# EAGLE design bigTransBrd (EAGLE 9.1.2)
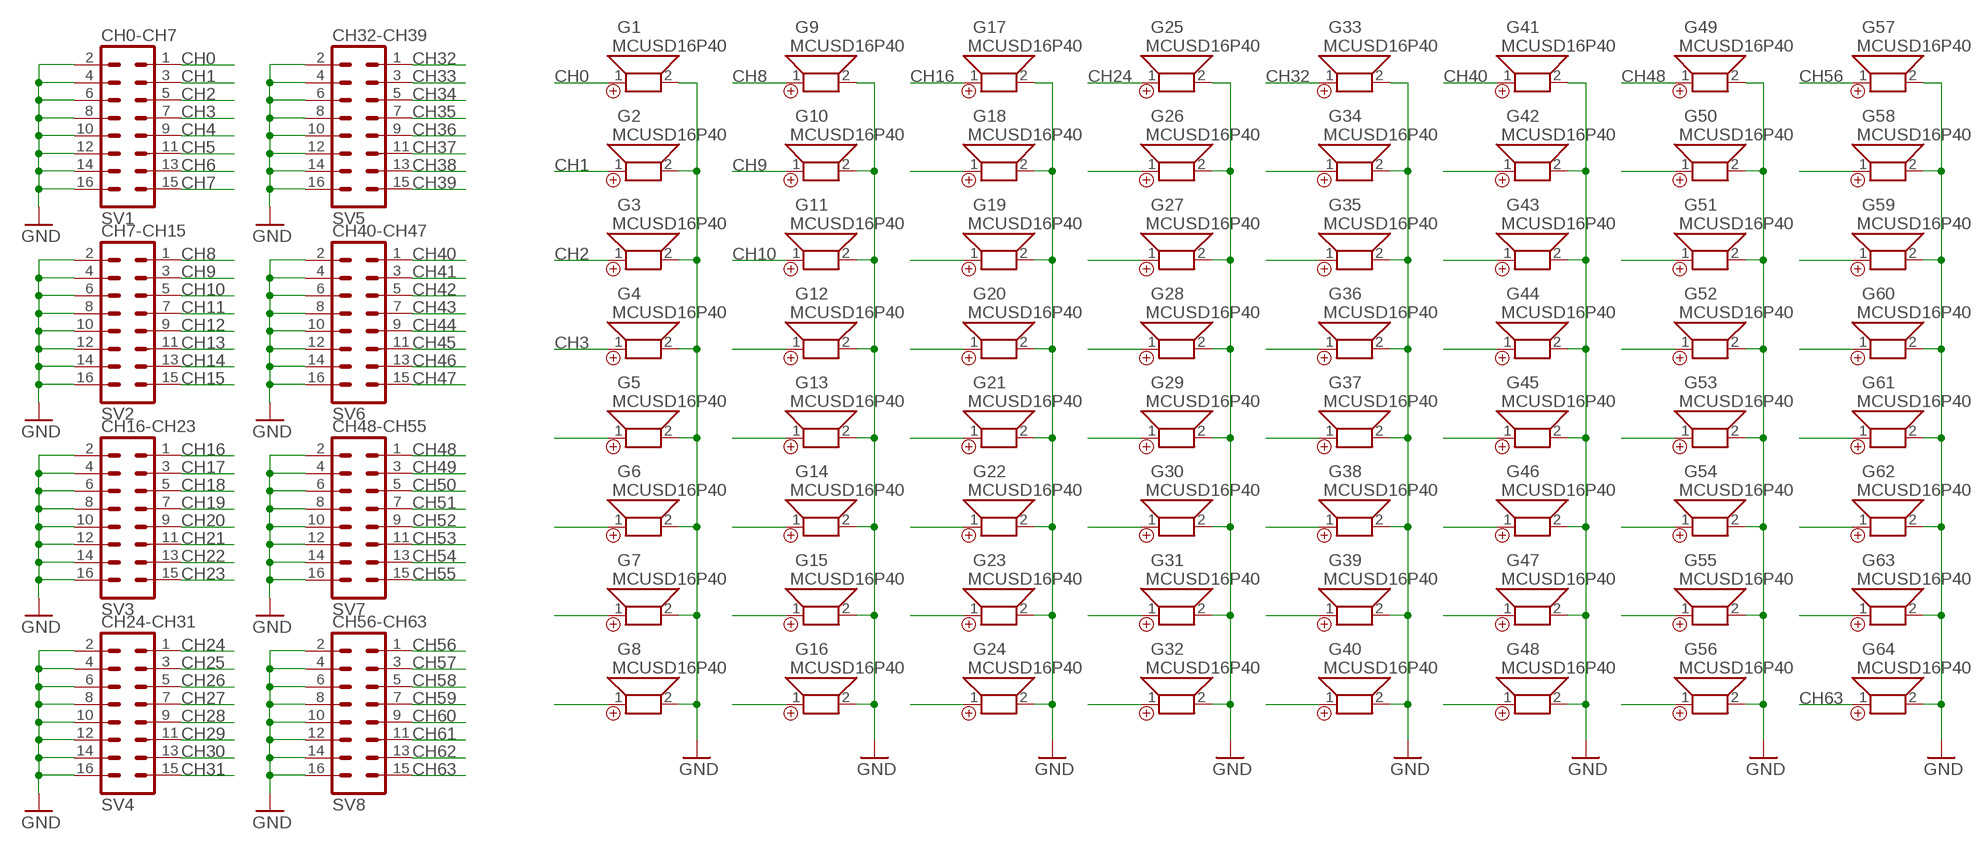
[diagram p0: schematic, sheet 1]

## Parts
G1  MCUSD16P40  [D16P40]
G2  MCUSD16P40  [D16P40]
G3  MCUSD16P40  [D16P40]
G4  MCUSD16P40  [D16P40]
G5  MCUSD16P40  [D16P40]
G6  MCUSD16P40  [D16P40]
G7  MCUSD16P40  [D16P40]
G8  MCUSD16P40  [D16P40]
G9  MCUSD16P40  [D16P40]
G10  MCUSD16P40  [D16P40]
G11  MCUSD16P40  [D16P40]
G12  MCUSD16P40  [D16P40]
G13  MCUSD16P40  [D16P40]
G14  MCUSD16P40  [D16P40]
G15  MCUSD16P40  [D16P40]
G16  MCUSD16P40  [D16P40]
G17  MCUSD16P40  [D16P40]
G18  MCUSD16P40  [D16P40]
G19  MCUSD16P40  [D16P40]
G20  MCUSD16P40  [D16P40]
G21  MCUSD16P40  [D16P40]
G22  MCUSD16P40  [D16P40]
G23  MCUSD16P40  [D16P40]
G24  MCUSD16P40  [D16P40]
G25  MCUSD16P40  [D16P40]
G26  MCUSD16P40  [D16P40]
G27  MCUSD16P40  [D16P40]
G28  MCUSD16P40  [D16P40]
G29  MCUSD16P40  [D16P40]
G30  MCUSD16P40  [D16P40]
G31  MCUSD16P40  [D16P40]
G32  MCUSD16P40  [D16P40]
G33  MCUSD16P40  [D16P40]
G34  MCUSD16P40  [D16P40]
G35  MCUSD16P40  [D16P40]
G36  MCUSD16P40  [D16P40]
G37  MCUSD16P40  [D16P40]
G38  MCUSD16P40  [D16P40]
G39  MCUSD16P40  [D16P40]
G40  MCUSD16P40  [D16P40]
G41  MCUSD16P40  [D16P40]
G42  MCUSD16P40  [D16P40]
G43  MCUSD16P40  [D16P40]
G44  MCUSD16P40  [D16P40]
G45  MCUSD16P40  [D16P40]
G46  MCUSD16P40  [D16P40]
G47  MCUSD16P40  [D16P40]
G48  MCUSD16P40  [D16P40]
G49  MCUSD16P40  [D16P40]
G50  MCUSD16P40  [D16P40]
G51  MCUSD16P40  [D16P40]
G52  MCUSD16P40  [D16P40]
G53  MCUSD16P40  [D16P40]
G54  MCUSD16P40  [D16P40]
G55  MCUSD16P40  [D16P40]
G56  MCUSD16P40  [D16P40]
G57  MCUSD16P40  [D16P40]
G58  MCUSD16P40  [D16P40]
G59  MCUSD16P40  [D16P40]
G60  MCUSD16P40  [D16P40]
G61  MCUSD16P40  [D16P40]
G62  MCUSD16P40  [D16P40]
G63  MCUSD16P40  [D16P40]
G64  MCUSD16P40  [D16P40]
SV1  CH0-CH7  ML16  [ML16]
SV2  CH7-CH15  ML16  [ML16]
SV3  CH16-CH23  ML16  [ML16]
SV4  CH24-CH31  ML16  [ML16]
SV5  CH32-CH39  ML16  [ML16]
SV6  CH40-CH47  ML16  [ML16]
SV7  CH48-CH55  ML16  [ML16]
SV8  CH56-CH63  ML16  [ML16]

## Nets
CH0: G1.1 SV1.1
CH1: G2.1 SV1.3
CH2: G3.1 SV1.5
CH3: G4.1 SV1.7
CH4: G5.1 SV1.9
CH5: G6.1 SV1.11
CH6: G7.1 SV1.13
CH7: G8.1 SV1.15
CH8: G9.1 SV2.1
CH9: G10.1 SV2.3
CH10: G11.1 SV2.5
CH11: G12.1 SV2.7
CH12: G13.1 SV2.9
CH13: G14.1 SV2.11
CH14: G15.1 SV2.13
CH15: G16.1 SV2.15
CH16: G17.1 SV3.1
CH17: G18.1 SV3.3
CH18: G19.1 SV3.5
CH19: G20.1 SV3.7
CH20: G21.1 SV3.9
CH21: G22.1 SV3.11
CH22: G23.1 SV3.13
CH23: G24.1 SV3.15
CH24: G25.1 SV4.1
CH25: G26.1 SV4.3
CH26: G27.1 SV4.5
CH27: G28.1 SV4.7
CH28: G29.1 SV4.9
CH29: G30.1 SV4.11
CH30: G31.1 SV4.13
CH31: G32.1 SV4.15
CH32: G33.1 SV5.1
CH33: G34.1 SV5.3
CH34: G35.1 SV5.5
CH35: G36.1 SV5.7
CH36: G37.1 SV5.9
CH37: G38.1 SV5.11
CH38: G39.1 SV5.13
CH39: G40.1 SV5.15
CH40: G41.1 SV6.1
CH41: G42.1 SV6.3
CH42: G43.1 SV6.5
CH43: G44.1 SV6.7
CH44: G45.1 SV6.9
CH45: G46.1 SV6.11
CH46: G47.1 SV6.13
CH47: G48.1 SV6.15
CH48: G49.1 SV7.1
CH49: G50.1 SV7.3
CH50: G51.1 SV7.5
CH51: G52.1 SV7.7
CH52: G53.1 SV7.9
CH53: G54.1 SV7.11
CH54: G55.1 SV7.13
CH55: G56.1 SV7.15
CH56: G57.1 SV8.1
CH57: G58.1 SV8.3
CH58: G59.1 SV8.5
CH59: G60.1 SV8.7
CH60: G61.1 SV8.9
CH61: G62.1 SV8.11
CH62: G63.1 SV8.13
CH63: G64.1 SV8.15
GND: G1.2 G2.2 G3.2 G4.2 G5.2 G6.2 G7.2 G8.2 G9.2 G10.2 G11.2 G12.2 G13.2 G14.2 G15.2 G16.2 G17.2 G18.2 G19.2 G20.2 G21.2 G22.2 G23.2 G24.2 G25.2 G26.2 G27.2 G28.2 G29.2 G30.2 G31.2 G32.2 G33.2 G34.2 G35.2 G36.2 G37.2 G38.2 G39.2 G40.2 G41.2 G42.2 G43.2 G44.2 G45.2 G46.2 G47.2 G48.2 G49.2 G50.2 G51.2 G52.2 G53.2 G54.2 G55.2 G56.2 G57.2 G58.2 G59.2 G60.2 G61.2 G62.2 G63.2 G64.2 SV1.2 SV1.4 SV1.6 SV1.8 SV1.10 SV1.12 SV1.14 SV1.16 SV2.2 SV2.4 SV2.6 SV2.8 SV2.10 SV2.12 SV2.14 SV2.16 SV3.2 SV3.4 SV3.6 SV3.8 SV3.10 SV3.12 SV3.14 SV3.16 SV4.2 SV4.4 SV4.6 SV4.8 SV4.10 SV4.12 SV4.14 SV4.16 SV5.2 SV5.4 SV5.6 SV5.8 SV5.10 SV5.12 SV5.14 SV5.16 SV6.2 SV6.4 SV6.6 SV6.8 SV6.10 SV6.12 SV6.14 SV6.16 SV7.2 SV7.4 SV7.6 SV7.8 SV7.10 SV7.12 SV7.14 SV7.16 SV8.2 SV8.4 SV8.6 SV8.8 SV8.10 SV8.12 SV8.14 SV8.16

## Library data of the parts
G1-G64 = projectLib:MCUSD16P40: MULTICOMP 16mm 40kHz ultrasonic transducer
SV1-SV8 = con-harting-ml:ML16: HARTING; OC_FARNELL: unknown; OC_NEWARK: unknown

## Board
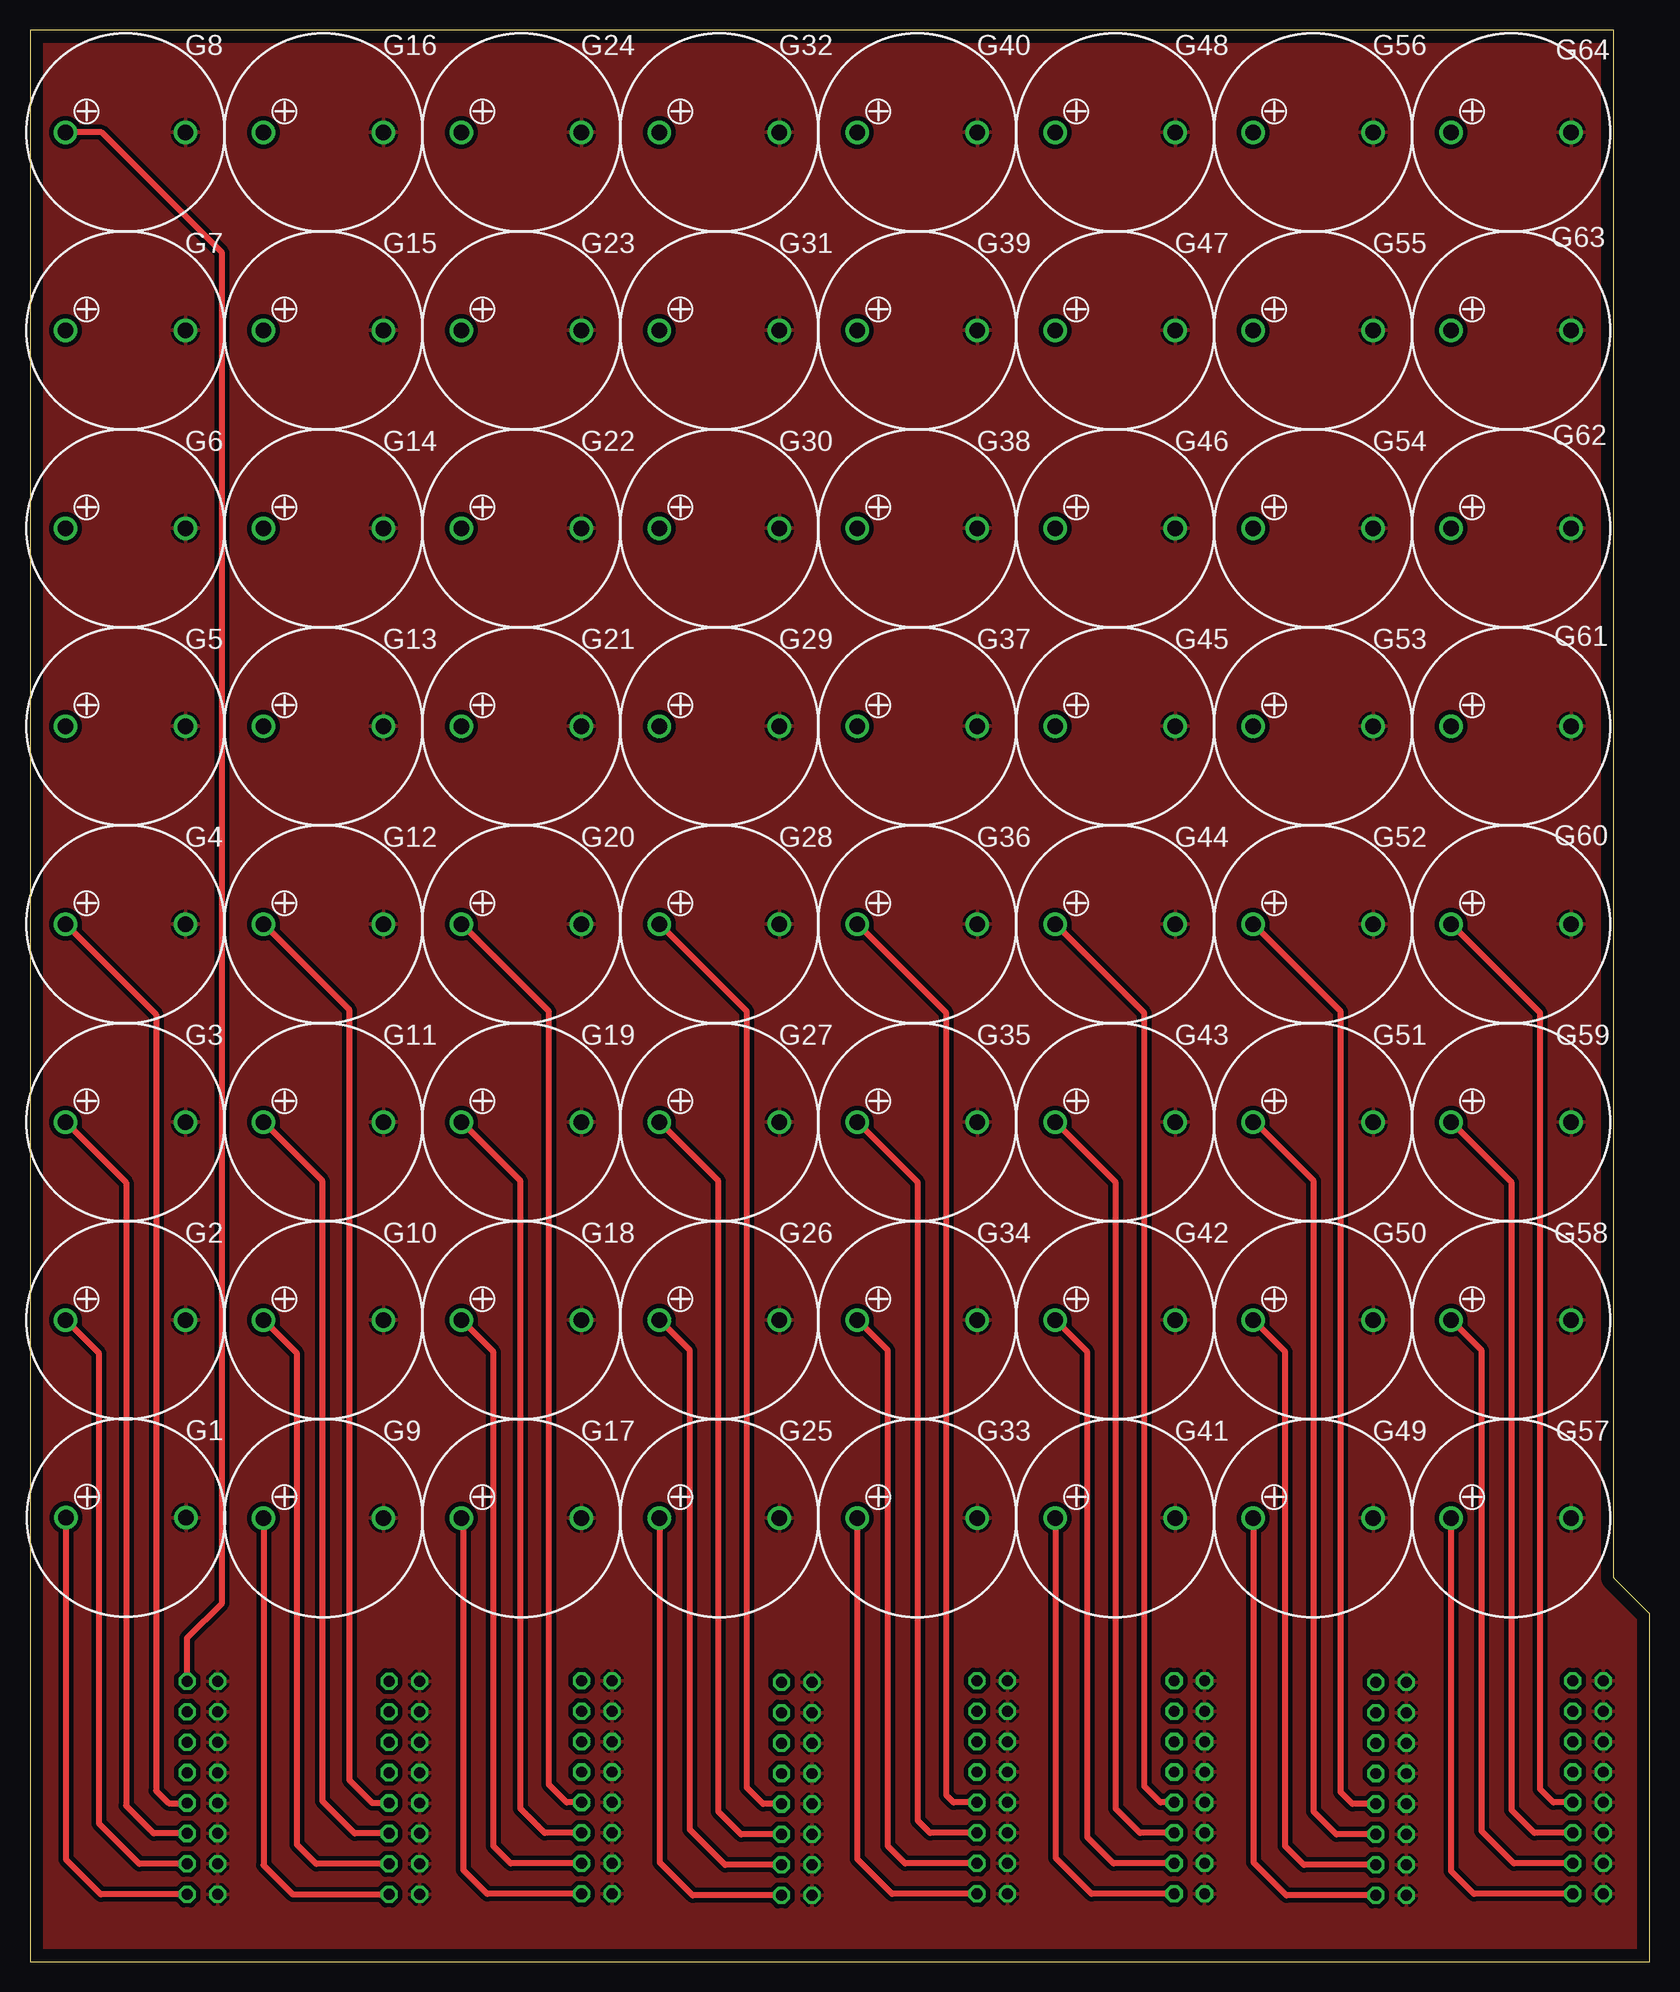
[diagram p1: board, top side]
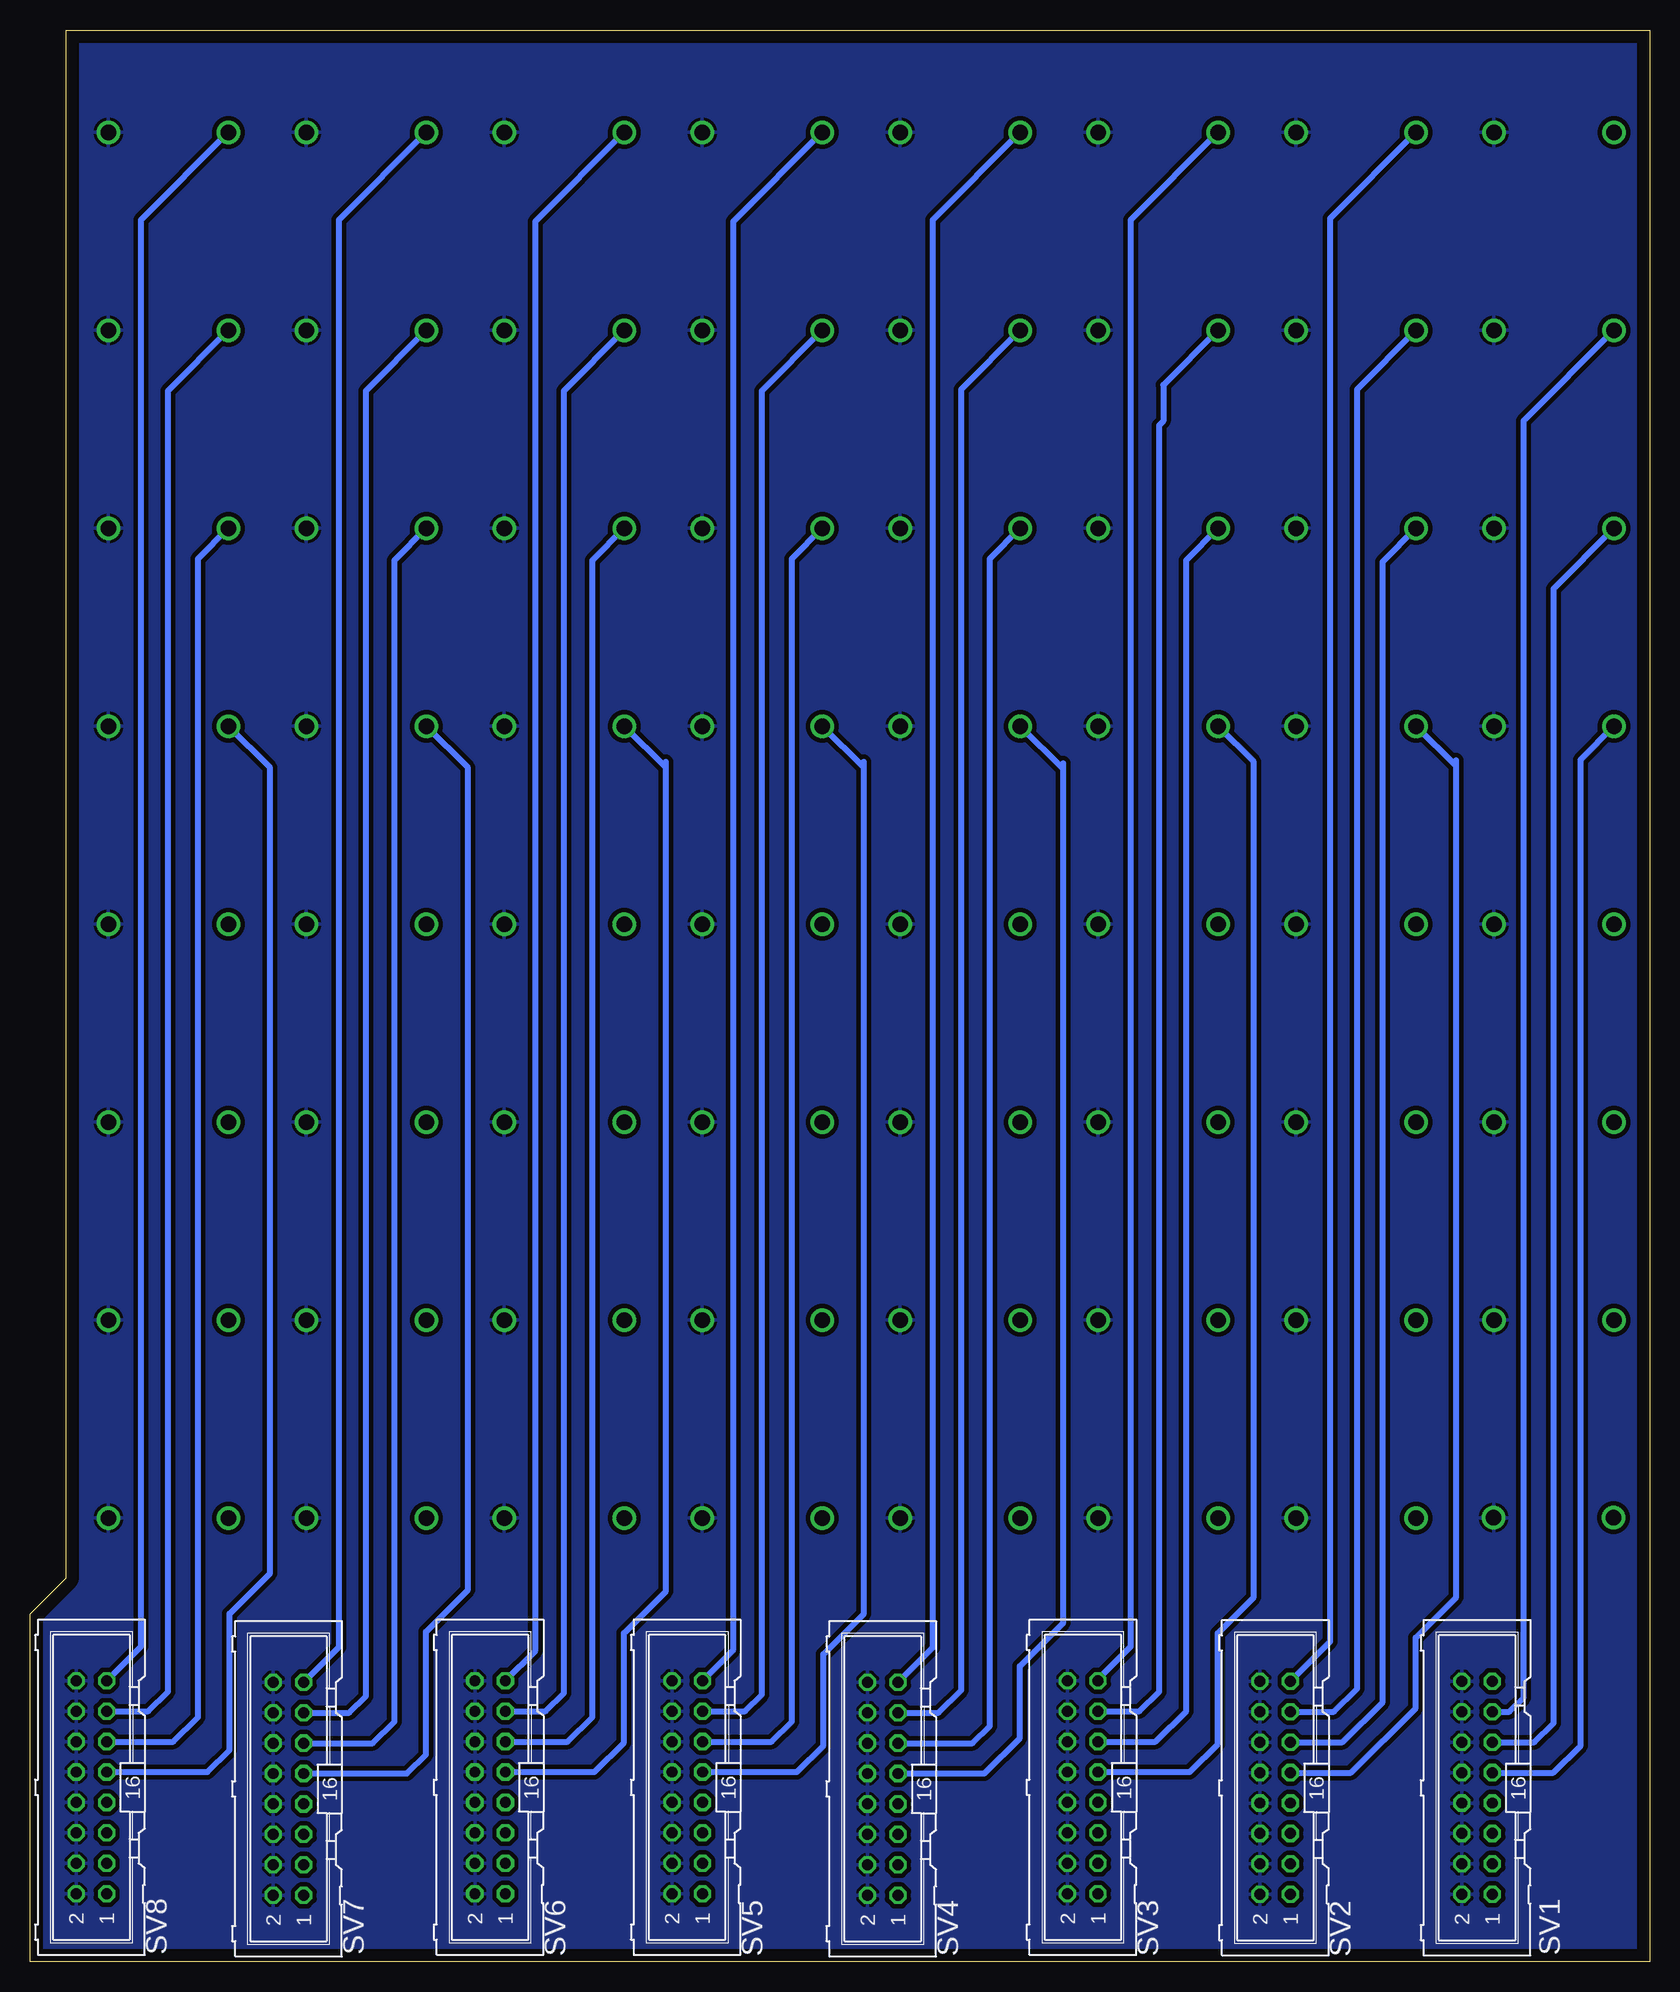
[diagram p2: board, bottom side, seen from below]

Size 135 x 161 mm. Coordinates in mm from the lower left corner, seen from the top.
Outline: 0,0 94.5,0 135,0 135,29 132,32 132,161 0,161 0,0
Copper layers (1*16): Top 0.035mm / dielectric 1.5mm / Bottom 0.035mm
Design rules "default *": minimum track width 6mil, minimum drill 0.35mm, track to track 15mil, track to pad 15mil, pad to pad 15mil, via to via 15mil, smd to smd 12mil, copper to edge 40mil, drill to drill 6mil, minimum pad ring 10mil, minimum via ring 8mil, stop-mask expansion 4mil, vias tented up to drill 0mil, thermal gap 10mil

### Footprints (pad centres in the part's own frame; a part is rotated, then mirrored left to right if it is on the bottom)
D16P40 = drill 1.3: 1 -5,0; 2 5,0
ML16 = drill 0.914 octagon: 1 -8.89,-1.27; 2 -8.89,1.27; 3 -6.35,-1.27; 4 -6.35,1.27; 5 -3.81,-1.27; 6 -3.81,1.27; 7 -1.27,-1.27; 8 -1.27,1.27; 9 1.27,-1.27; 10 1.27,1.27; 11 3.81,-1.27; 12 3.81,1.27; 13 6.35,-1.27; 14 6.35,1.27; 15 8.89,-1.27; 16 8.89,1.27

### Placement (x,y rotation side)
G1  8,37 0 top
G2  7.96,53.46 0 top
G3  7.96,69.96 0 top
G4  7.96,86.46 0 top
G5  7.96,102.96 0 top
G6  7.96,119.46 0 top
G7  7.96,135.96 0 top
G8  7.96,152.46 0 top
G9  24.46,36.96 0 top
G10  24.46,53.46 0 top
G11  24.46,69.96 0 top
G12  24.46,86.46 0 top
G13  24.46,102.96 0 top
G14  24.46,119.46 0 top
G15  24.46,135.96 0 top
G16  24.46,152.46 0 top
G17  40.96,36.96 0 top
G18  40.96,53.46 0 top
G19  40.96,69.96 0 top
G20  40.96,86.46 0 top
G21  40.96,102.96 0 top
G22  40.96,119.46 0 top
G23  40.96,135.96 0 top
G24  40.96,152.46 0 top
G25  57.46,36.96 0 top
G26  57.46,53.46 0 top
G27  57.46,69.96 0 top
G28  57.46,86.46 0 top
G29  57.46,102.96 0 top
G30  57.46,119.46 0 top
G31  57.46,135.96 0 top
G32  57.46,152.46 0 top
G33  73.96,36.96 0 top
G34  73.96,53.46 0 top
G35  73.96,69.96 0 top
G36  73.96,86.46 0 top
G37  73.96,102.96 0 top
G38  73.96,119.46 0 top
G39  73.96,135.96 0 top
G40  73.96,152.46 0 top
G41  90.46,36.96 0 top
G42  90.46,53.46 0 top
G43  90.46,69.96 0 top
G44  90.46,86.46 0 top
G45  90.46,102.96 0 top
G46  90.46,119.46 0 top
G47  90.46,135.96 0 top
G48  90.46,152.46 0 top
G49  106.96,36.96 0 top
G50  106.96,53.46 0 top
G51  106.96,69.96 0 top
G52  106.96,86.46 0 top
G53  106.96,102.96 0 top
G54  106.96,119.46 0 top
G55  106.96,135.96 0 top
G56  106.96,152.46 0 top
G57  123.46,36.96 0 top
G58  123.46,53.46 0 top
G59  123.46,69.96 0 top
G60  123.46,86.46 0 top
G61  123.46,102.96 0 top
G62  123.46,119.46 0 top
G63  123.46,135.96 0 top
G64  123.46,152.46 0 top
SV1  14.37,14.48 90 bottom
SV2  31.2,14.48 90 bottom
SV3  47.23,14.52 90 bottom
SV4  63.91,14.4 90 bottom
SV5  80.22,14.52 90 bottom
SV6  96.65,14.52 90 bottom
SV7  113.45,14.4 90 bottom
SV8  129.88,14.52 90 bottom

### Tracks (layer width: path | path; a pad name or v marks a point on that pad's centre or on a via)
CH0
  Top 0.5: SV1.1 5.91,5.59 3,8.5 G1.1
CH1
  Top 0.5: SV1.3 9.12,8.13 5.75,11.5 5.75,50.67 G2.1
CH2
  Top 0.45: 9.75,11.25 10.25,10.75 10.33,10.67
  Top 0.5: G3.1 8,64.92 8,13 9.75,11.25 10.33,10.67 SV1.5
CH3
  Top 0.5: G4.1 10.5,78.92 10.5,14.25 11.54,13.21 SV1.7
CH4
  Bottom 0.5: SV1.9 8,15.75 5.75,18 5.75,100.17 G5.1
CH5
  Bottom 0.5: SV1.11 9.59,18.29 8,19.88 8,114.42 G6.1
CH6
  Bottom 0.5: SV1.13 11.67,20.83 10.5,22 10.5,128.42 G7.1
CH7
  Top 0.5: SV1.15 13.1,26.98 16,29.88 16,142.42 5.96,152.46 G8.1
CH8
  Top 0.5: SV2.1 21.91,5.59 19.46,8.04 G9.1
CH9
  Top 0.5: SV2.3 23.87,8.13 22.25,9.75 22.25,50.67 G10.1
CH10
  Top 0.5: SV2.5 27.08,10.67 24.38,13.38 24.38,65.05 G11.1
CH11
  Top 0.5: SV2.7 28.54,13.21 26.62,15.12 26.62,79.3 G12.1
CH12
  Bottom 0.5: SV2.9 24.88,15.75 19.5,21.12 19.5,27 16.12,30.38 | G13.1 16.12,99.63 16.12,30.38 | 16.12,30.38 16.12,100.13
CH13
  Bottom 0.5: SV2.11 25.59,18.29 22.25,21.62 22.25,116.67 G14.1
CH14
  Bottom 0.5: SV2.13 26.3,20.83 24.38,22.75 24.38,131.05 G15.1
CH15
  Bottom 0.5: SV2.15 26.62,26.67 26.62,145.3 G16.1
CH16
  Top 0.5: SV3.1 38.12,5.63 36.12,7.62 36.12,36.8 G17.1
CH17
  Top 0.5: SV3.3 40.08,8.17 38.62,9.62 38.62,50.8 G18.1
CH18
  Top 0.5: SV3.5 42.91,10.71 40.88,12.75 40.88,65.05 G19.1
CH19
  Top 0.5: SV3.7 44.75,13.25 43.25,14.75 43.25,79.17 G20.1
CH20
  Bottom 0.5: SV3.9 38.33,15.79 36,18.12 36,27.38 33,30.38 33,100 G21.1
CH21
  Bottom 0.5: SV3.11 41.17,18.33 38.62,20.88 38.62,116.8 G22.1
CH22
  Bottom 0.45: 40.52,128.4 40.88,128.05
  Bottom 0.5: SV3.13 42.5,20.87 40.88,22.5 40.88,128.05 | G23.1 40.52,131.4 40.52,128.4
CH23
  Bottom 0.5: G24.1 43.25,145.17 43.25,26.25 45.96,23.54 SV3.15
CH24
  Top 0.5: SV4.1 55.24,5.51 52.5,8.25 52.5,36.88 52.46,36.92 G25.1
CH25
  Top 0.5: SV4.3 57.95,8.05 55,11 55,50.92 G26.1
CH26
  Top 0.5: SV4.5 59.29,10.59 57.38,12.5 57.38,65.05 G27.1
CH27
  Top 0.5: SV4.7 61.12,13.13 59.75,14.5 59.75,79.17 G28.1
CH28
  Bottom 0.5: SV4.9 55.46,15.67 52.5,18.62 52.5,24.62 48.88,28.25 | G29.1 48.88,99.38 48.88,28.25 | 48.88,28.25 48.88,99.88
CH29
  Bottom 0.5: SV4.11 56.42,18.21 55,19.62 55,116.92 G30.1
CH30
  Bottom 0.5: SV4.13 59.25,20.75 57.38,22.62 57.38,131.05 G31.1
CH31
  Bottom 0.5: SV4.15 59.75,26.18 59.75,145.17 G32.1
CH32
  Top 0.5: SV5.1 71.87,5.63 68.96,8.54 G33.1
CH33
  Top 0.5: SV5.3 72.95,8.17 71.5,9.62 71.5,50.92 G34.1
CH34
  Top 0.5: SV5.5 75.04,10.71 74,11.75 74,64.92 G35.1
CH35
  Top 0.5: SV5.7 77,13.25 76.38,13.88 76.38,79.05 G36.1
CH36
  Bottom 0.5: SV5.9 71.08,15.79 68.88,18 68.88,25.62 65.5,29 | 65.5,29 65.5,99.5 G37.1 | 65.5,29 65.5,100
CH37
  Bottom 0.5: SV5.11 73.17,18.33 71.5,20 71.5,116.92 G38.1
CH38
  Bottom 0.5: SV5.13 75.38,20.87 74,22.25 74,130.92 G39.1
CH39
  Bottom 0.5: SV5.15 76.38,25.98 76.38,145.05 G40.1
CH40
  Top 0.5: SV6.1 88.49,5.63 85.5,8.62 85.5,36.92 G41.1
CH41
  Top 0.5: SV6.3 90.33,8.17 88.12,10.38 88.12,50.8 G42.1
CH42
  Top 0.5: SV6.5 92.54,10.71 90.5,12.75 90.5,64.92 G43.1
CH43
  Top 0.5: SV6.7 94.25,13.25 92.88,14.62 92.88,79.05 G44.1
CH44
  Bottom 0.5: SV6.9 87.96,15.79 85.5,18.25 85.5,27.38 82,30.88 | 82,30.88 82,99.5 G45.1 | 82,30.88 82,100
CH45
  Bottom 0.5: SV6.11 90.17,18.33 88.12,20.38 88.12,116.8 G46.1
CH46
  Bottom 0.5: SV6.13 92,20.87 90.5,22.38 90.5,130.92 G47.1
CH47
  Bottom 0.5: SV6.15 92.88,25.91 92.88,145.05 G48.1
CH48
  Top 0.5: SV7.1 104.74,5.51 102,8.25 102,36.92 G49.1
CH49
  Top 0.5: SV7.3 106.2,8.05 104.62,9.62 104.62,50.8 G50.1
CH50
  Top 0.5: SV7.5 108.91,10.59 107,12.5 107,65.05 102.08,69.96 G51.1
CH51
  Top 0.5: SV7.7 110.25,13.13 109.25,14.12 109.25,79.17 G52.1
CH52
  Bottom 0.5: SV7.9 103.58,15.67 102,17.25 102,27.5 98.5,31 | 98.5,31 98.5,99.5 G53.1 | 98.5,31 98.5,98
CH53
  Bottom 0.5: SV7.11 106.42,18.21 104.62,20 104.62,116.8 G54.1
CH54
  Bottom 0.5: SV7.13 108.38,20.75 107,22.12 107,130.92 G55.1
CH55
  Bottom 0.5: SV7.15 109.25,26.22 109.25,145.17 G56.1
CH56
  Top 0.5: SV8.1 120.37,5.63 118.46,7.54 G57.1
CH57
  Top 0.5: SV8.3 123.7,8.17 121,10.88 121,50.92 G58.1
CH58
  Top 0.5: SV8.5 125.41,10.71 123.5,12.62 123.5,64.92 G59.1
CH59
  Top 0.5: SV8.7 127,13.25 125.88,14.38 125.88,79.05 G60.1
CH60
  Bottom 0.5: SV8.9 120.21,15.79 118.38,17.62 118.38,29 115,32.38 | 115,32.38 115,99.5 G61.1 | 115,32.38 115,98
CH61
  Bottom 0.5: SV8.11 123.04,18.33 121,20.38 121,116.92 G62.1
CH62
  Bottom 0.5: SV8.13 125.13,20.87 123.5,22.5 123.5,130.92 G63.1
CH63
  Bottom 0.5: SV8.15 125.75,26.27 125.75,145.17 G64.1
GND
  pour Top: -0.25,0 138.41,0 138.41,160.62 -0.25,160.62
  pour Bottom: -0.53,0 138.38,0 138.38,160.5 -0.53,160.5